# Altium schematic sheet Potentiometer.SchDoc
size A4
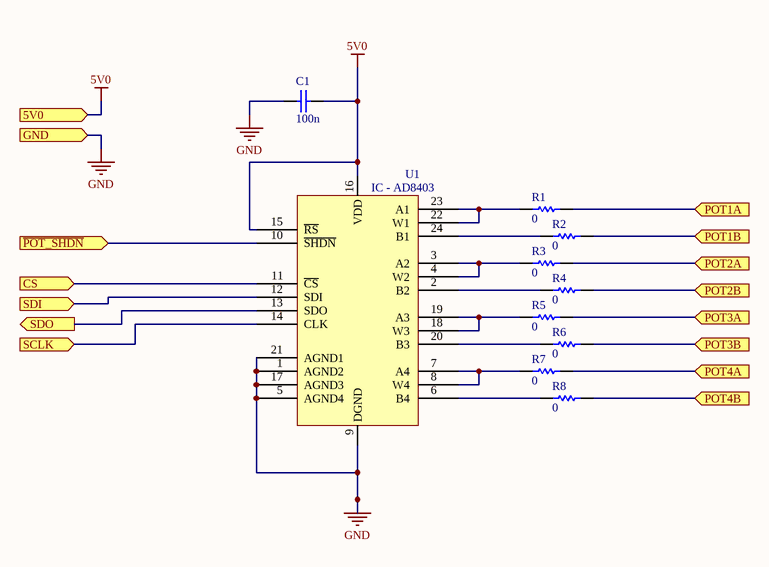
[diagram p0: Potentiometer.SchDoc]

## Parts
C1  value 100n  [CS-0603]  (hidden comment: CS - CAPACITOR)
R1  value 0  [RS-0402]  (hidden comment: RS - RESISTOR)
R2  value 0  [RS-0402]  (hidden comment: RS - RESISTOR)
R3  value 0  [RS-0402]  (hidden comment: RS - RESISTOR)
R4  value 0  [RS-0402]  (hidden comment: RS - RESISTOR)
R5  value 0  [RS-0402]  (hidden comment: RS - RESISTOR)
R6  value 0  [RS-0402]  (hidden comment: RS - RESISTOR)
R7  value 0  [RS-0402]  (hidden comment: RS - RESISTOR)
R8  value 0  [RS-0402]  (hidden comment: RS - RESISTOR)
U1  IC - AD8403  [IC-SOIC-24]

## Ports
5V0, CS (in), GND, POT1A (in), POT1B (in), POT2A (in), POT2B (in), POT3A (in), POT3B (in), POT4A (in), POT4B (in), SCLK (in), SDI (in), SDO (out), ~{POT_SHDN} (in)

## Nets
5V0: C1.1 U1.15(~{RS}) U1.16(VDD) ; port 5V0
GND: C1.2 U1.1(AGND2) U1.5(AGND4) U1.9(DGND) U1.17(AGND3) U1.21(AGND1) ; port GND
CS: U1.11(~{CS}) ; port CS
~{POT_SHDN}: U1.10(~{SHDN}) ; port ~{POT_SHDN}
POT1A: R1.1 ; port POT1A
POT1B: R2.1 ; port POT1B
POT2A: R3.1 ; port POT2A
POT2B: R4.1 ; port POT2B
POT3A: R5.1 ; port POT3A
POT3B: R6.1 ; port POT3B
POT4A: R7.1 ; port POT4A
POT4B: R8.1 ; port POT4B
SCLK: U1.14(CLK) ; port SCLK
SDI: U1.12(SDI) ; port SDI
SDO: U1.13(SDO) ; port SDO
NetR1_2: R1.2 U1.22(W1) U1.23(A1)
NetR2_2: R2.2 U1.24(B1)
NetR3_2: R3.2 U1.3(A2) U1.4(W2)
NetR4_2: R4.2 U1.2(B2)
NetR5_2: R5.2 U1.18(W3) U1.19(A3)
NetR6_2: R6.2 U1.20(B3)
NetR7_2: R7.2 U1.7(A4) U1.8(W4)
NetR8_2: R8.2 U1.6(B4)

## Library data of the parts
C1 = CS - CAPACITOR: TOLERANCE: 10%; VOLTAGE: 16V; Supplier 1: *; Supplier Part Number 1: *; (FIELD A): *; (FLIED C): *; (FIELD B): *; Manufacturer: *
R1-R8 = RS - RESISTOR: TOLERANCE: RES TOL; POWER: RES POWER; Supplier Part Number 1: *; Supplier 1: *; (FIELD A): *; (FLIED C): *; (FIELD B): *; Manufacturer: *
U1 = IC - AD8403: DIGITAL POTENTIOMETER; (FIELD A): *; (FIELD B): *; (FIELD C): *; Manufacturer: *; Supplier 1: Digi-Key; Supplier Part Number 1: AD8403ARZ10-ND